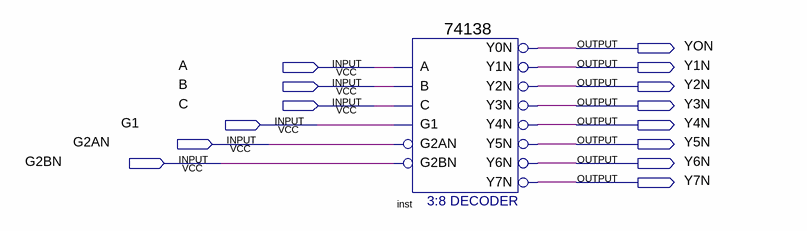
[diagram p0: schematic sheet]
// Quartus schematic _38Decoder.bdf as structural Verilog: 1 symbols, 14 pins
module _38Decoder (
  input  A,
  input  B,
  input  C,
  input  G1,
  input  G2AN,
  input  G2BN,
  output YON,
  output Y1N,
  output Y2N,
  output Y3N,
  output Y4N,
  output Y5N,
  output Y6N,
  output Y7N
);

  \74138  inst (
    .A(A), .B(B), .G1(G1), .C(C), .G2AN(G2AN), .G2BN(G2BN), .Y0N(YON), .Y1N(Y1N), .Y2N(Y2N), .Y3N(Y3N),
    .Y4N(Y4N), .Y5N(Y5N), .Y6N(Y6N), .Y7N(Y7N));
endmodule
